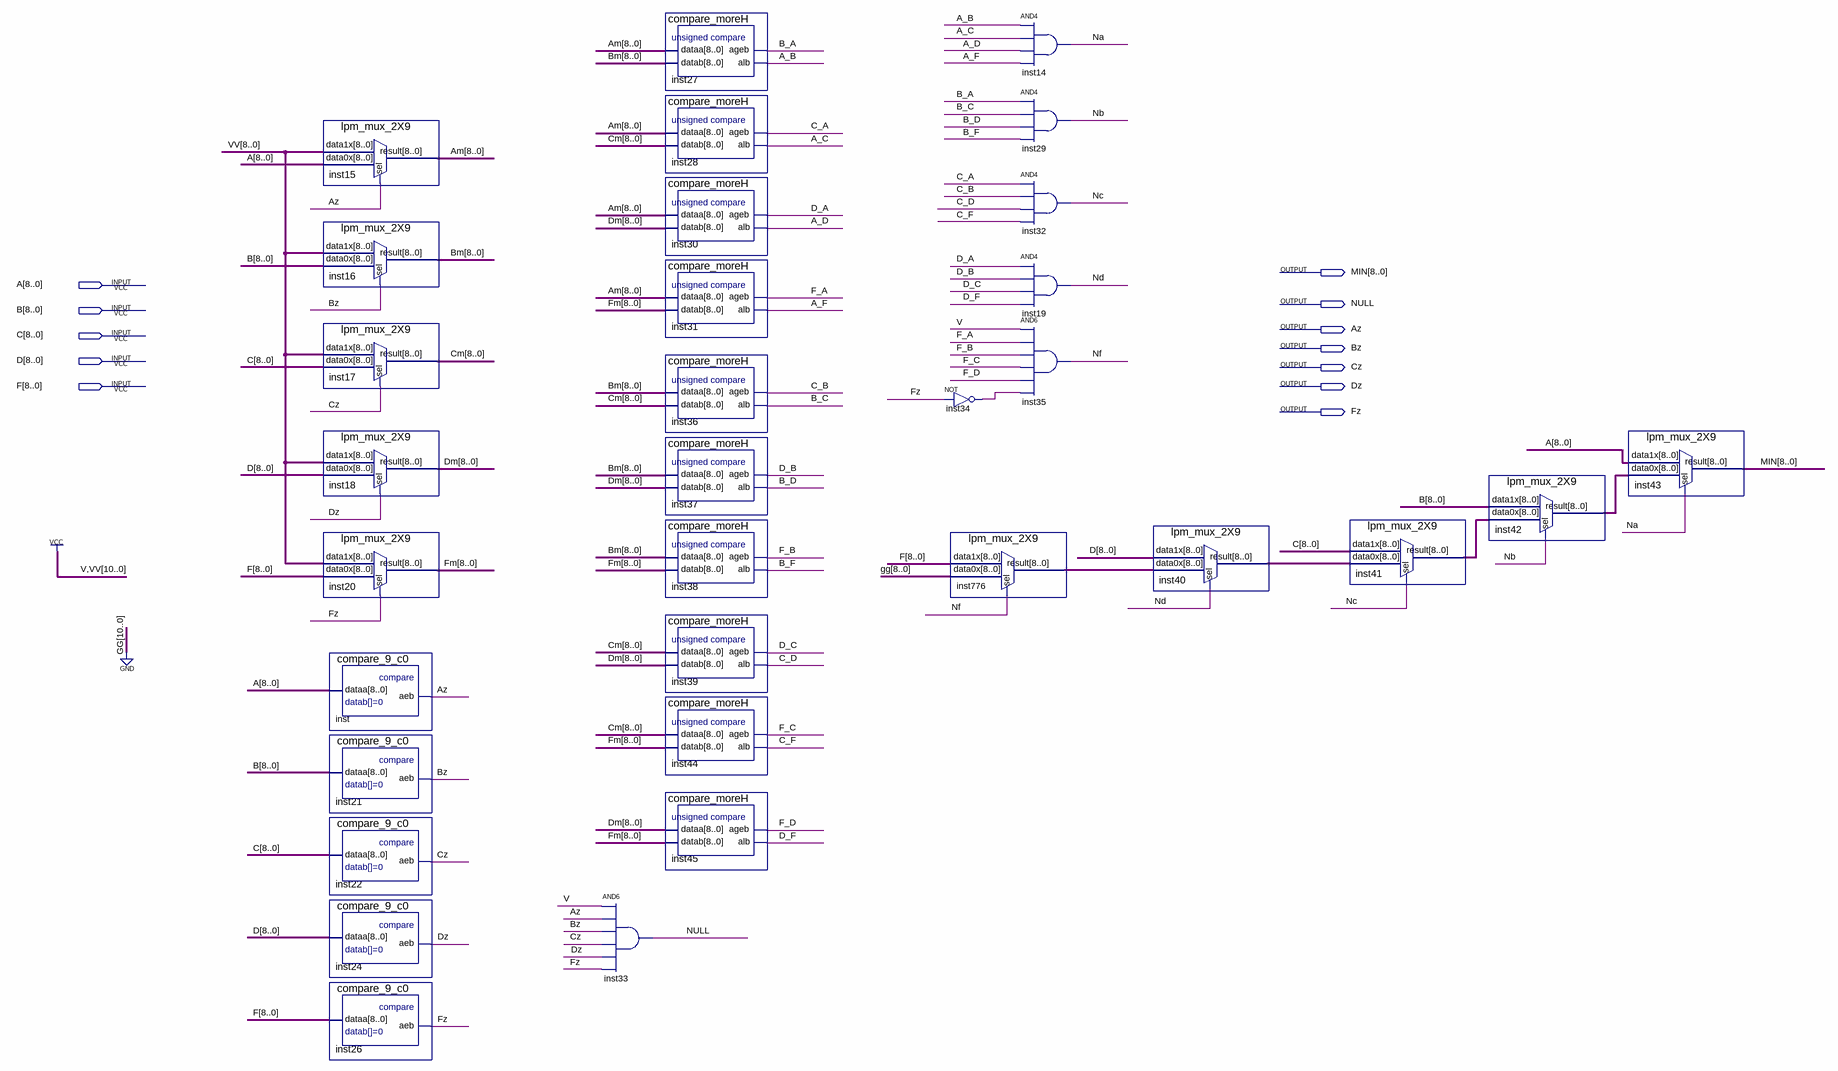
[diagram p0: schematic sheet]
// Quartus schematic MINIMUM_h.bdf as structural Verilog: 32 symbols, 12 pins
module MINIMUM_h (
  input  [8:0] A,
  input  [8:0] B,
  input  [8:0] C,
  input  [8:0] D,
  input  [8:0] F,
  output [8:0] MIN,
  output NULL,
  output Az,
  output Bz,
  output Cz,
  output Dz,
  output Fz
);

  wire A_B, A_C, A_D, A_F, B_A, B_C, B_D, B_F, C_A, C_B, C_D, C_F, D_A, D_B, D_C, D_F, F_A, F_B, F_C, F_D,
       inst34_out, Na, Nb, Nc, Nd, Nf;
  wire [8:0] Am, Bm, Cm, Dm, Fm, inst40_result, inst41_result, inst42_result, inst776_result;

  lpm_mux_2X9 inst15 (.data1x({9{1'b1}}), .data0x(A), .sel(Az), .result(Am));
  lpm_mux_2X9 inst16 (.data1x({9{1'b1}}), .data0x(B), .sel(Bz), .result(Bm));
  lpm_mux_2X9 inst17 (.data1x({9{1'b1}}), .data0x(C), .sel(Cz), .result(Cm));
  lpm_mux_2X9 inst18 (.data1x({9{1'b1}}), .data0x(D), .sel(Dz), .result(Dm));
  lpm_mux_2X9 inst20 (.data1x({9{1'b1}}), .data0x(F), .sel(Fz), .result(Fm));
  compare_9_c0 inst (.dataa(A), .aeb(Az));
  compare_9_c0 inst21 (.dataa(B), .aeb(Bz));
  compare_9_c0 inst22 (.dataa(C), .aeb(Cz));
  compare_9_c0 inst24 (.dataa(D), .aeb(Dz));
  compare_9_c0 inst26 (.dataa(F), .aeb(Fz));
  and inst33 (NULL, 1'b1, Az, Bz, Cz, Dz, Fz);
  compare_moreH inst27 (.dataa(Am), .datab(Bm), .ageb(B_A), .alb(A_B));
  compare_moreH inst28 (.dataa(Am), .datab(Cm), .ageb(C_A), .alb(A_C));
  compare_moreH inst30 (.dataa(Am), .datab(Dm), .ageb(D_A), .alb(A_D));
  compare_moreH inst31 (.dataa(Am), .datab(Fm), .ageb(F_A), .alb(A_F));
  compare_moreH inst36 (.dataa(Bm), .datab(Cm), .ageb(C_B), .alb(B_C));
  compare_moreH inst37 (.dataa(Bm), .datab(Dm), .ageb(D_B), .alb(B_D));
  compare_moreH inst38 (.dataa(Bm), .datab(Fm), .ageb(F_B), .alb(B_F));
  compare_moreH inst39 (.dataa(Cm), .datab(Dm), .ageb(D_C), .alb(C_D));
  compare_moreH inst44 (.dataa(Cm), .datab(Fm), .ageb(F_C), .alb(C_F));
  compare_moreH inst45 (.dataa(Dm), .datab(Fm), .ageb(F_D), .alb(D_F));
  not inst34 (inst34_out, Fz);
  lpm_mux_2X9 inst776 (.data1x(F), .data0x({9{1'b0}}), .sel(Nf), .result(inst776_result));
  and inst14 (Na, A_B, A_C, A_D, A_F);
  and inst29 (Nb, B_A, B_C, B_D, B_F);
  and inst32 (Nc, C_A, C_B, C_D, C_F);
  and inst19 (Nd, D_A, D_B, D_C, D_F);
  and inst35 (Nf, 1'b1, F_A, F_B, F_C, F_D, inst34_out);
  lpm_mux_2X9 inst40 (.data1x(D), .data0x(inst776_result), .sel(Nd), .result(inst40_result));
  lpm_mux_2X9 inst41 (.data1x(C), .data0x(inst40_result), .sel(Nc), .result(inst41_result));
  lpm_mux_2X9 inst42 (.data1x(B), .data0x(inst41_result), .sel(Nb), .result(inst42_result));
  lpm_mux_2X9 inst43 (.data1x(A), .data0x(inst42_result), .sel(Na), .result(MIN));
endmodule
